# Altium schematic sheet MCU2.SchDoc
size A3; Organization: Altium Limited; Address1: L3, 12a Rodborough Rd; Address2: Frenchs Forest; Address3: NSW; Address4: Australia 2086
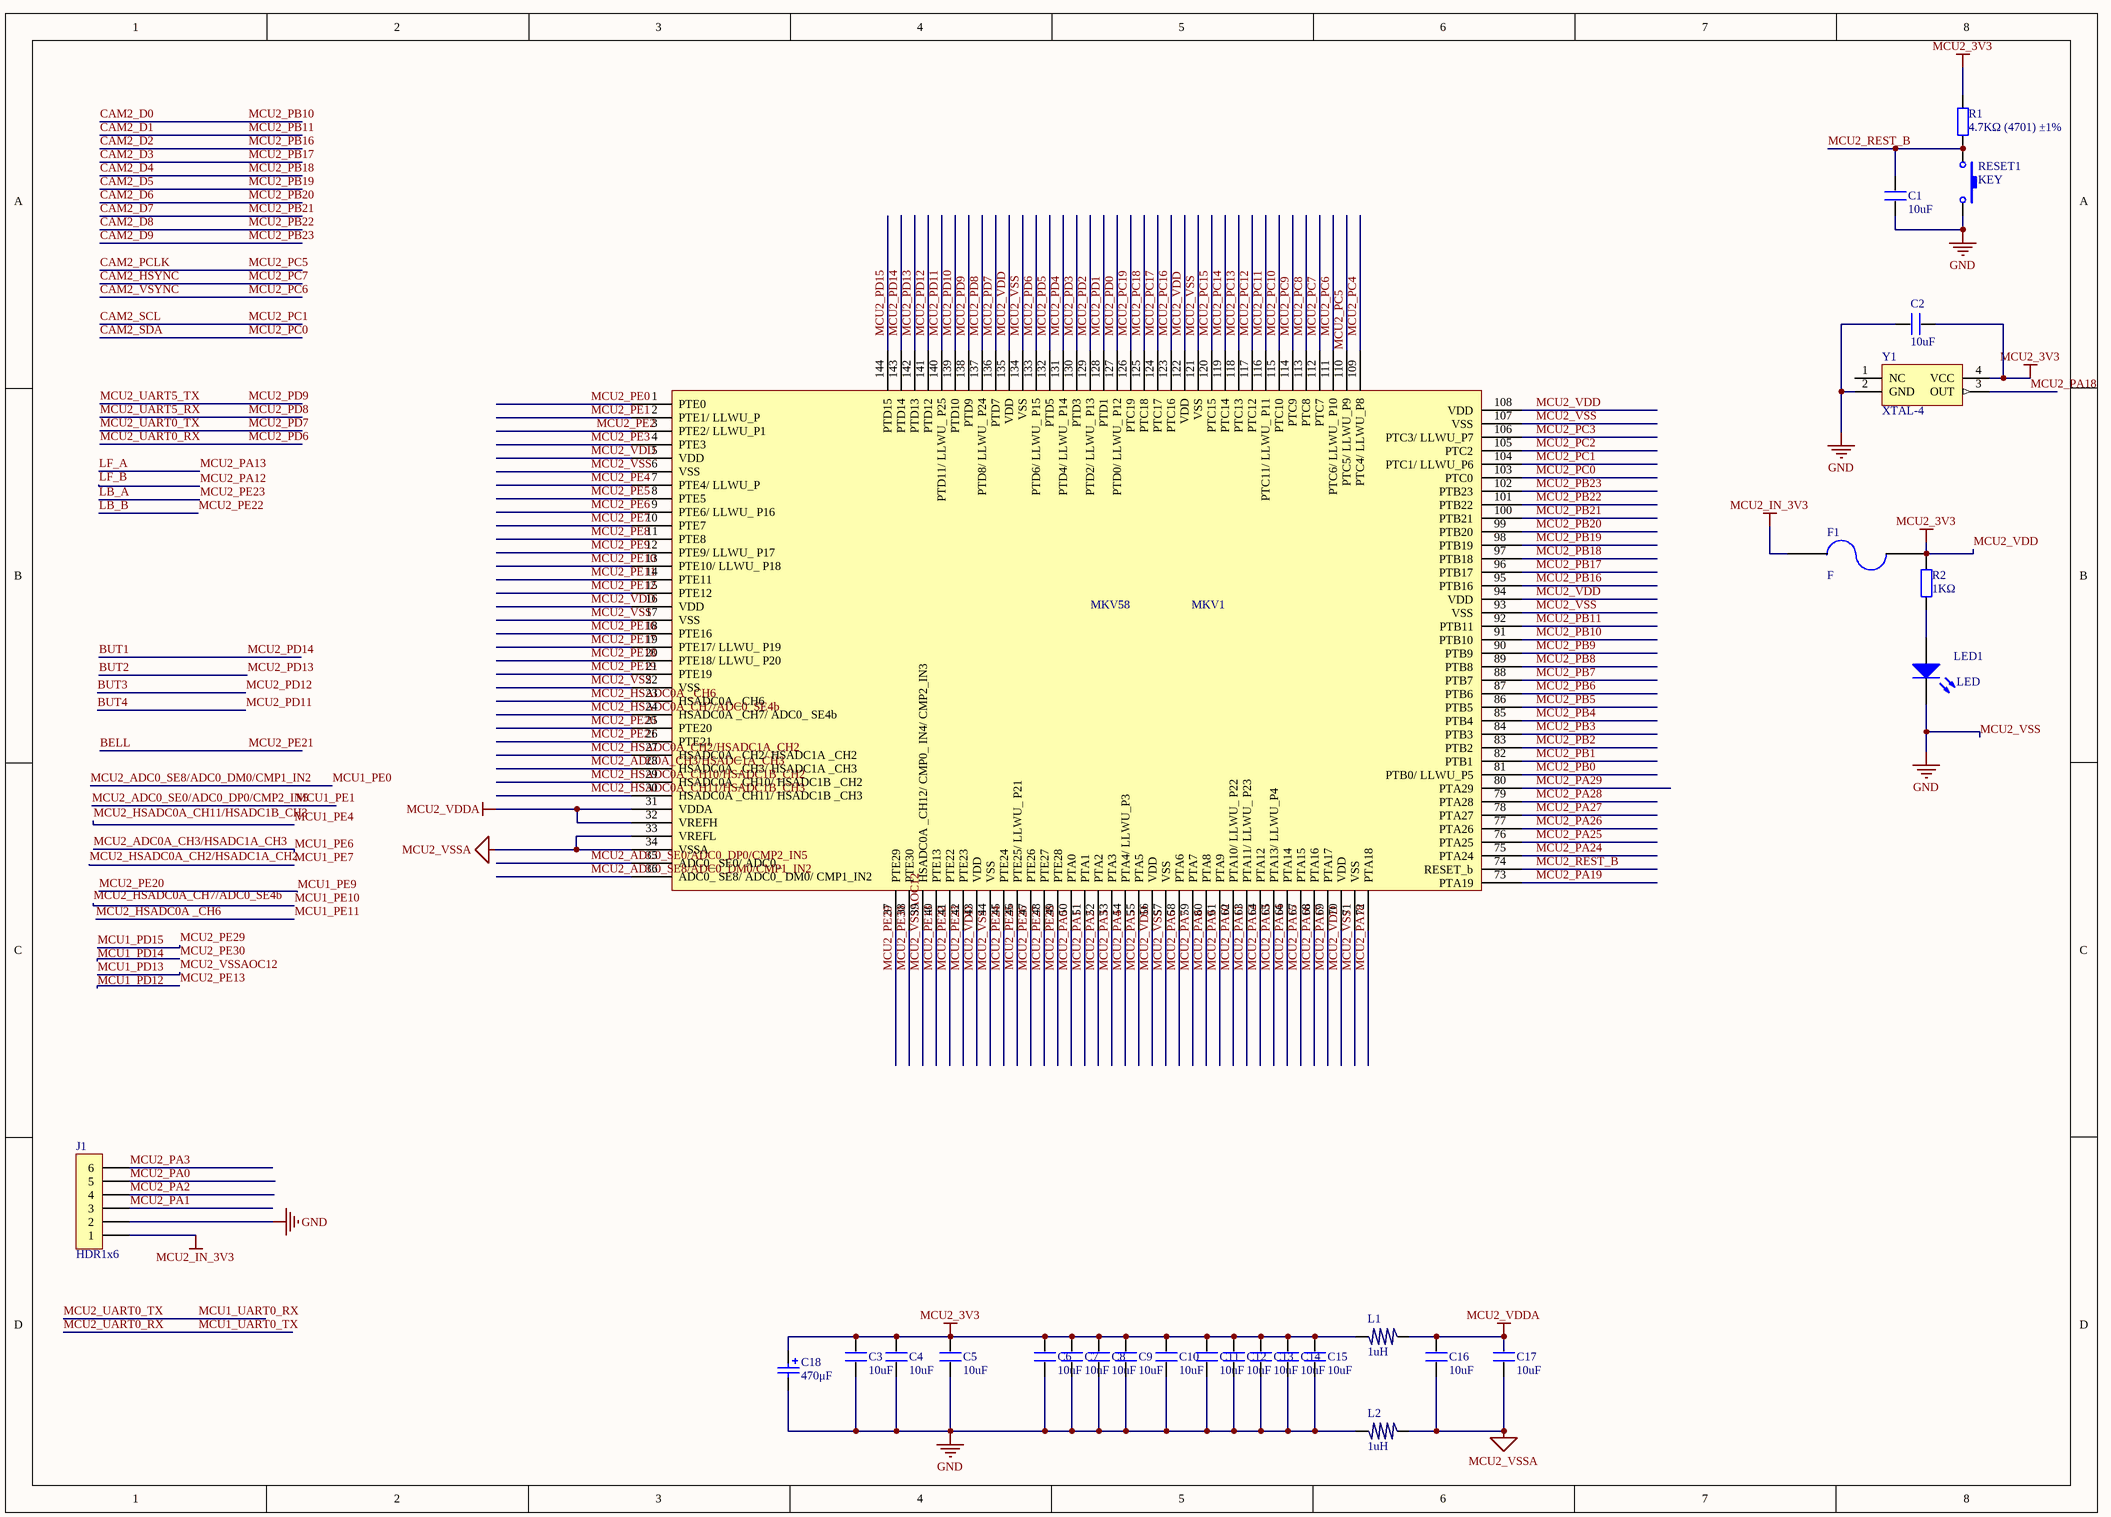
[diagram p0: MCU2.SchDoc]

## Parts
C1  10uF  [0805_C]
C2  10uF  [0805_C]
C3  10uF  [0805_C]
C4  10uF  [0805_C]
C5  10uF  [0805_C]
C6  10uF  [0805_C]
C7  10uF  [0805_C]
C8  10uF  [0805_C]
C9  10uF  [0805_C]
C10  10uF  [0805_C]
C11  10uF  [0805_C]
C12  10uF  [0805_C]
C13  10uF  [0805_C]
C14  10uF  [0805_C]
C15  10uF  [0805_C]
C16  10uF  [0805_C]
C17  10uF  [0805_C]
C18  470μF  [CASE C6032]
F1  F  [0805_R]
J1  HDR1x6  [PIN-6-2.54-1.0]
L1  1uH  [0805]
L2  1uH  [0805]
LED1  LED  [LED(0805)]
MKV1  MKV58  [LQFP144]
R1  4.7KΩ (4701) ±1%  [0805_R]
R2  1KΩ  [0805_R]
RESET1  KEY  [Key_PB]
Y1  XTAL-4  [XTAL-5.0X3.2]

## Nets
MCU2_IN_3V3: F1.1 J1.1
MCU2_VDD: C2.2 C3.2 C4.2 C5.2 C6.2 C7.2 C8.2 C9.2 C10.2 C11.2 C12.2 C13.2 C14.2 C15.2 C18.1 F1.2 L1.2 MKV1.5(VDD) MKV1.16(VDD) MKV1.43(VDD) MKV1.56(VDD) MKV1.70(VDD) MKV1.94(VDD) MKV1.108(VDD) MKV1.122(VDD) MKV1.135(VDD) R1.2 R2.2 Y1.4(VCC)  [also labelled MCU2_3V3]
MCU2_VDDA: C16.2 C17.2 L1.1 MKV1.31(VDDA) MKV1.32(VREFH)
MCU2_VSS: C1.1 C2.1 C3.1 C4.1 C5.1 C6.1 C7.1 C8.1 C9.1 C10.1 C11.1 C12.1 C13.1 C14.1 C15.1 C18.2 J1.2 L2.2 LED1.2(K) MKV1.6(VSS) MKV1.17(VSS) MKV1.22(VSS) MKV1.44(VSS) MKV1.57(VSS) MKV1.71(VSS) MKV1.93(VSS) MKV1.107(VSS) MKV1.121(VSS) MKV1.134(VSS) RESET1.2 Y1.2(GND)  [also labelled GND]
MCU2_VSSA: C16.1 C17.1 L2.1 MKV1.33(VREFL) MKV1.34(VSSA)
BELL: MKV1.26(PTE21)  [also labelled MCU2_PE21]
BUT1: MKV1.143(PTD14)  [also labelled MCU2_PD14]
BUT2: MKV1.142(PTD13)  [also labelled MCU2_PD13]
BUT3: MKV1.141(PTD12)  [also labelled MCU2_PD12]
BUT4: MKV1.140(PTD11/_LLWU__P25)  [also labelled MCU2_PD11]
CAM2_D0: MKV1.91(PTB10)  [also labelled MCU2_PB10]
CAM2_D1: MKV1.92(PTB11)  [also labelled MCU2_PB11]
CAM2_D2: MKV1.95(PTB16)  [also labelled MCU2_PB16]
CAM2_D3: MKV1.96(PTB17)  [also labelled MCU2_PB17]
CAM2_D4: MKV1.97(PTB18)  [also labelled MCU2_PB18]
CAM2_D5: MKV1.98(PTB19)  [also labelled MCU2_PB19]
CAM2_D6: MKV1.99(PTB20)  [also labelled MCU2_PB20]
CAM2_D7: MKV1.100(PTB21)  [also labelled MCU2_PB21]
CAM2_D8: MKV1.101(PTB22)  [also labelled MCU2_PB22]
CAM2_D9: MKV1.102(PTB23)  [also labelled MCU2_PB23]
CAM2_HSYNC: MKV1.112(PTC7)  [also labelled MCU2_PC7]
CAM2_PCLK: MKV1.110(PTC5/_LLWU_P9)  [also labelled MCU2_PC5]
CAM2_SCL: MKV1.104(PTC1/_LLWU_P6)  [also labelled MCU2_PC1]
CAM2_SDA: MKV1.103(PTC0)  [also labelled MCU2_PC0]
CAM2_VSYNC: MKV1.111(PTC6/_LLWU__P10)  [also labelled MCU2_PC6]
LB_A: MKV1.42(PTE23)  [also labelled MCU2_PE23]
LB_B: MKV1.41(PTE22)  [also labelled MCU2_PE22]
LF_A: MKV1.65(PTA13/_LLWU_P4)  [also labelled MCU2_PA13]
LF_B: MKV1.64(PTA12)  [also labelled MCU2_PA12]
MCU1_PD12: MKV1.40(PTE13)  [also labelled MCU2_PE13]
MCU1_PD13: MKV1.39(HSADC0A__CH12/_CMP0__IN4/_CMP2_IN3)  [also labelled MCU2_VSSAOC12]
MCU1_PD14: MKV1.38(PTE30)  [also labelled MCU2_PE30]
MCU1_PD15: MKV1.37(PTE29)  [also labelled MCU2_PE29]
MCU1_PE0: MKV1.36(ADC0__SE8/_ADC0__DM0/_CMP1_IN2)  [also labelled MCU2_ADC0_SE8/ADC0_DM0/CMP1_IN2]
MCU1_PE1: MKV1.35(ADC0__SE0/_ADC0_)  [also labelled MCU2_ADC0_SE0/ADC0_DP0/CMP2_IN5]
MCU1_PE4: MKV1.30(HSADC0A__CH11/_HSADC1B__CH3)  [also labelled MCU2_HSADC0A_CH11/HSADC1B_CH3]
MCU1_PE6: MKV1.28(HSADC0A__CH3/_HSADC1A__CH3)  [also labelled MCU2_ADC0A_CH3/HSADC1A_CH3]
MCU1_PE7: MKV1.27(HSADC0A__CH2/_HSADC1A__CH2)  [also labelled MCU2_HSADC0A_CH2/HSADC1A_CH2]
MCU1_PE9: MKV1.25(PTE20)  [also labelled MCU2_PE20]
MCU1_PE10: MKV1.24(HSADC0A__CH7/_ADC0__SE4b)  [also labelled MCU2_HSADC0A_CH7/ADC0_SE4b]
MCU1_PE11: MKV1.23(HSADC0A__CH6)  [also labelled MCU2_HSADC0A _CH6]
MCU1_UART0_RX: MKV1.136(PTD7)  [also labelled MCU2_PD7, MCU2_UART0_TX]
MCU1_UART0_TX: MKV1.133(PTD6/_LLWU__P15)  [also labelled MCU2_PD6, MCU2_UART0_RX]
MCU2_HSADC0A_CH10/HSADC1B_CH2: MKV1.29(HSADC0A__CH10/_HSADC1B__CH2)
MCU2_PA0: J1.5 MKV1.50(PTA0)
MCU2_PA1: J1.3 MKV1.51(PTA1)
MCU2_PA2: J1.4 MKV1.52(PTA2)
MCU2_PA3: J1.6 MKV1.53(PTA3)
MCU2_PA4: MKV1.54(PTA4/_LLWU_P3)
MCU2_PA5: MKV1.55(PTA5)
MCU2_PA6: MKV1.58(PTA6)
MCU2_PA7: MKV1.59(PTA7)
MCU2_PA8: MKV1.60(PTA8)
MCU2_PA9: MKV1.61(PTA9)
MCU2_PA10: MKV1.62(PTA10/_LLWU__P22)
MCU2_PA11: MKV1.63(PTA11/_LLWU__P23)
MCU2_PA14: MKV1.66(PTA14)
MCU2_PA15: MKV1.67(PTA15)
MCU2_PA16: MKV1.68(PTA16)
MCU2_PA17: MKV1.69(PTA17)
MCU2_PA18: MKV1.72(PTA18) Y1.3(OUT)
MCU2_PA19: MKV1.73(PTA19)
MCU2_PA24: MKV1.75(PTA24)
MCU2_PA25: MKV1.76(PTA25)
MCU2_PA26: MKV1.77(PTA26)
MCU2_PA27: MKV1.78(PTA27)
MCU2_PA28: MKV1.79(PTA28)
MCU2_PA29: MKV1.80(PTA29)
MCU2_PB0: MKV1.81(PTB0/_LLWU_P5)
MCU2_PB1: MKV1.82(PTB1)
MCU2_PB2: MKV1.83(PTB2)
MCU2_PB3: MKV1.84(PTB3)
MCU2_PB4: MKV1.85(PTB4)
MCU2_PB5: MKV1.86(PTB5)
MCU2_PB6: MKV1.87(PTB6)
MCU2_PB7: MKV1.88(PTB7)
MCU2_PB8: MKV1.89(PTB8)
MCU2_PB9: MKV1.90(PTB9)
MCU2_PC2: MKV1.105(PTC2)
MCU2_PC3: MKV1.106(PTC3/_LLWU_P7)
MCU2_PC4: MKV1.109(PTC4/_LLWU_P8)
MCU2_PC8: MKV1.113(PTC8)
MCU2_PC9: MKV1.114(PTC9)
MCU2_PC10: MKV1.115(PTC10)
MCU2_PC11: MKV1.116(PTC11/_LLWU__P11)
MCU2_PC12: MKV1.117(PTC12)
MCU2_PC13: MKV1.118(PTC13)
MCU2_PC14: MKV1.119(PTC14)
MCU2_PC15: MKV1.120(PTC15)
MCU2_PC16: MKV1.123(PTC16)
MCU2_PC17: MKV1.124(PTC17)
MCU2_PC18: MKV1.125(PTC18)
MCU2_PC19: MKV1.126(PTC19)
MCU2_PD0: MKV1.127(PTD0/_LLWU__P12)
MCU2_PD1: MKV1.128(PTD1)
MCU2_PD2: MKV1.129(PTD2/_LLWU__P13)
MCU2_PD3: MKV1.130(PTD3)
MCU2_PD4: MKV1.131(PTD4/_LLWU__P14)
MCU2_PD5: MKV1.132(PTD5)
MCU2_PD8: MKV1.137(PTD8/_LLWU__P24)  [also labelled MCU2_UART5_RX]
MCU2_PD9: MKV1.138(PTD9)  [also labelled MCU2_UART5_TX]
MCU2_PD10: MKV1.139(PTD10)
MCU2_PD15: MKV1.144(PTD15)
MCU2_PE0: MKV1.1(PTE0)
MCU2_PE1: MKV1.2(PTE1/_LLWU_P)
MCU2_PE2: MKV1.3(PTE2/_LLWU_P1)
MCU2_PE3: MKV1.4(PTE3)
MCU2_PE4: MKV1.7(PTE4/_LLWU_P)
MCU2_PE5: MKV1.8(PTE5)
MCU2_PE6: MKV1.9(PTE6/_LLWU__P16)
MCU2_PE7: MKV1.10(PTE7)
MCU2_PE8: MKV1.11(PTE8)
MCU2_PE9: MKV1.12(PTE9/_LLWU__P17)
MCU2_PE10: MKV1.13(PTE10/_LLWU__P18)
MCU2_PE11: MKV1.14(PTE11)
MCU2_PE12: MKV1.15(PTE12)
MCU2_PE16: MKV1.18(PTE16)
MCU2_PE17: MKV1.19(PTE17/_LLWU__P19)
MCU2_PE18: MKV1.20(PTE18/_LLWU__P20)
MCU2_PE19: MKV1.21(PTE19)
MCU2_PE24: MKV1.45(PTE24)
MCU2_PE25: MKV1.46(PTE25/_LLWU__P21)
MCU2_PE26: MKV1.47(PTE26)
MCU2_PE27: MKV1.48(PTE27)
MCU2_PE28: MKV1.49(PTE28)
MCU2_REST_B: C1.2 MKV1.74(RESET_b) R1.1 RESET1.1
NetLED1_1: LED1.1(A) R2.1

Not connected (* = marked no-connect by the designer): Y1 1(NC)

## Notes on the sheet
- Title
- Size:
- Date:
- A3
- Number:
- Time:
- Revision:
- Sheet
- of
- File:

## Library data of the parts
C1-C17 = C
C18 = Cap(Ta)
J1 = HDR1x6: Connector
L1 L2 = L
LED1 = LED(0805)
R1 = 0805 4.7KΩ (4701) 1%: 贴片电阻; ComponentLink1Description: 供应商链接; ComponentLink1URL: http://www.szlcsc.com/product/details_18361.html; Package: 0805; Supplier: LC; SuppliersPartNumber: C17673
R2 = 0805 1.5KΩ (1501) 1%: 贴片电阻; ComponentLink1Description: 供应商链接; ComponentLink1URL: http://www.szlcsc.com/product/details_4717.html; Package: 0805; Supplier: LC; SuppliersPartNumber: C4310
RESET1 = Key_1
Y1 = XTAL-4: Oscillator